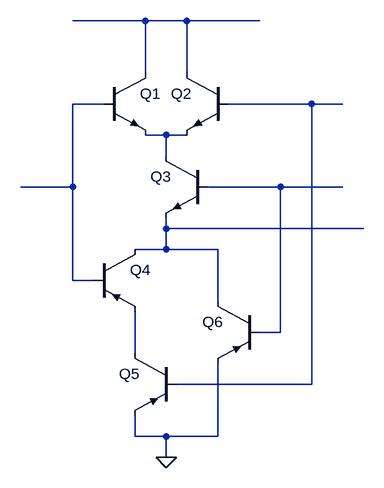
[diagram p0: schematic CMOS.asc]
CMOS.asc, the LTspice schematic file:
Version 4
SHEET 1 880 680
WIRE -128 -400 -240 -400
WIRE -64 -400 -128 -400
WIRE 48 -400 -64 -400
WIRE -128 -320 -128 -400
WIRE -64 -320 -64 -400
WIRE -192 -272 -240 -272
WIRE 128 -272 0 -272
WIRE 176 -272 128 -272
WIRE -96 -224 -128 -224
WIRE -64 -224 -96 -224
WIRE -96 -192 -96 -224
WIRE -240 -144 -240 -272
WIRE -240 -144 -320 -144
WIRE 80 -144 -32 -144
WIRE 176 -144 80 -144
WIRE -96 -80 -96 -96
WIRE 208 -80 -96 -80
WIRE -96 -48 -96 -80
WIRE -96 -48 -144 -48
WIRE -16 -48 -96 -48
WIRE -240 0 -240 -144
WIRE -208 0 -240 0
WIRE -16 32 -16 -48
WIRE 80 80 80 -144
WIRE 80 80 48 80
WIRE -144 112 -144 48
WIRE 128 160 128 -272
WIRE 128 160 -80 160
WIRE -144 240 -144 208
WIRE -96 240 -144 240
WIRE -16 240 -16 128
WIRE -16 240 -96 240
WIRE -96 272 -96 240
FLAG -96 272 0
SYMBOL npn -192 -320 R0
SYMATTR InstName Q1
SYMATTR Value ""
SYMBOL npn 0 -320 M0
SYMATTR InstName Q2
SYMATTR Value ""
SYMBOL npn -32 -192 M0
SYMATTR InstName Q3
SYMATTR Value ""
SYMBOL pnp -208 -48 R0
SYMATTR InstName Q4
SYMATTR Value ""
SYMBOL pnp -80 112 M0
SYMATTR InstName Q5
SYMATTR Value ""
SYMBOL pnp 48 32 M0
SYMATTR InstName Q6
SYMATTR Value ""

The netlist it stands for:
* CMOS.asc
Q1 N001 N002 N004 0
Q2 N001 N003 N004 0
Q3 N004 N005 N006 0
Q4 N006 N002 N007 0
Q5 N007 N003 0 0
Q6 N006 N005 0 0
.model NPN NPN
.model PNP PNP
.lib standard.bjt
.backanno
.end